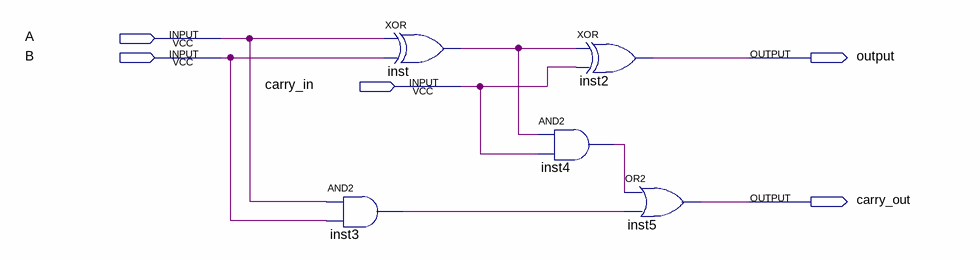
[diagram p0: schematic sheet]
// Quartus schematic somador.bdf as structural Verilog: 5 symbols, 5 pins
module somador (
  input  A,
  input  B,
  input  carry_in,
  output \output ,
  output carry_out
);

  wire inst3_out, inst4_out, inst_out;

  and inst3 (inst3_out, A, B);
  xor inst (inst_out, A, B);
  xor inst2 (\output , inst_out, carry_in);
  and inst4 (inst4_out, inst_out, carry_in);
  or inst5 (carry_out, inst4_out, inst3_out);
endmodule
